# Altium schematic sheet 32B48P_Dev_Board.SchDoc
size A3
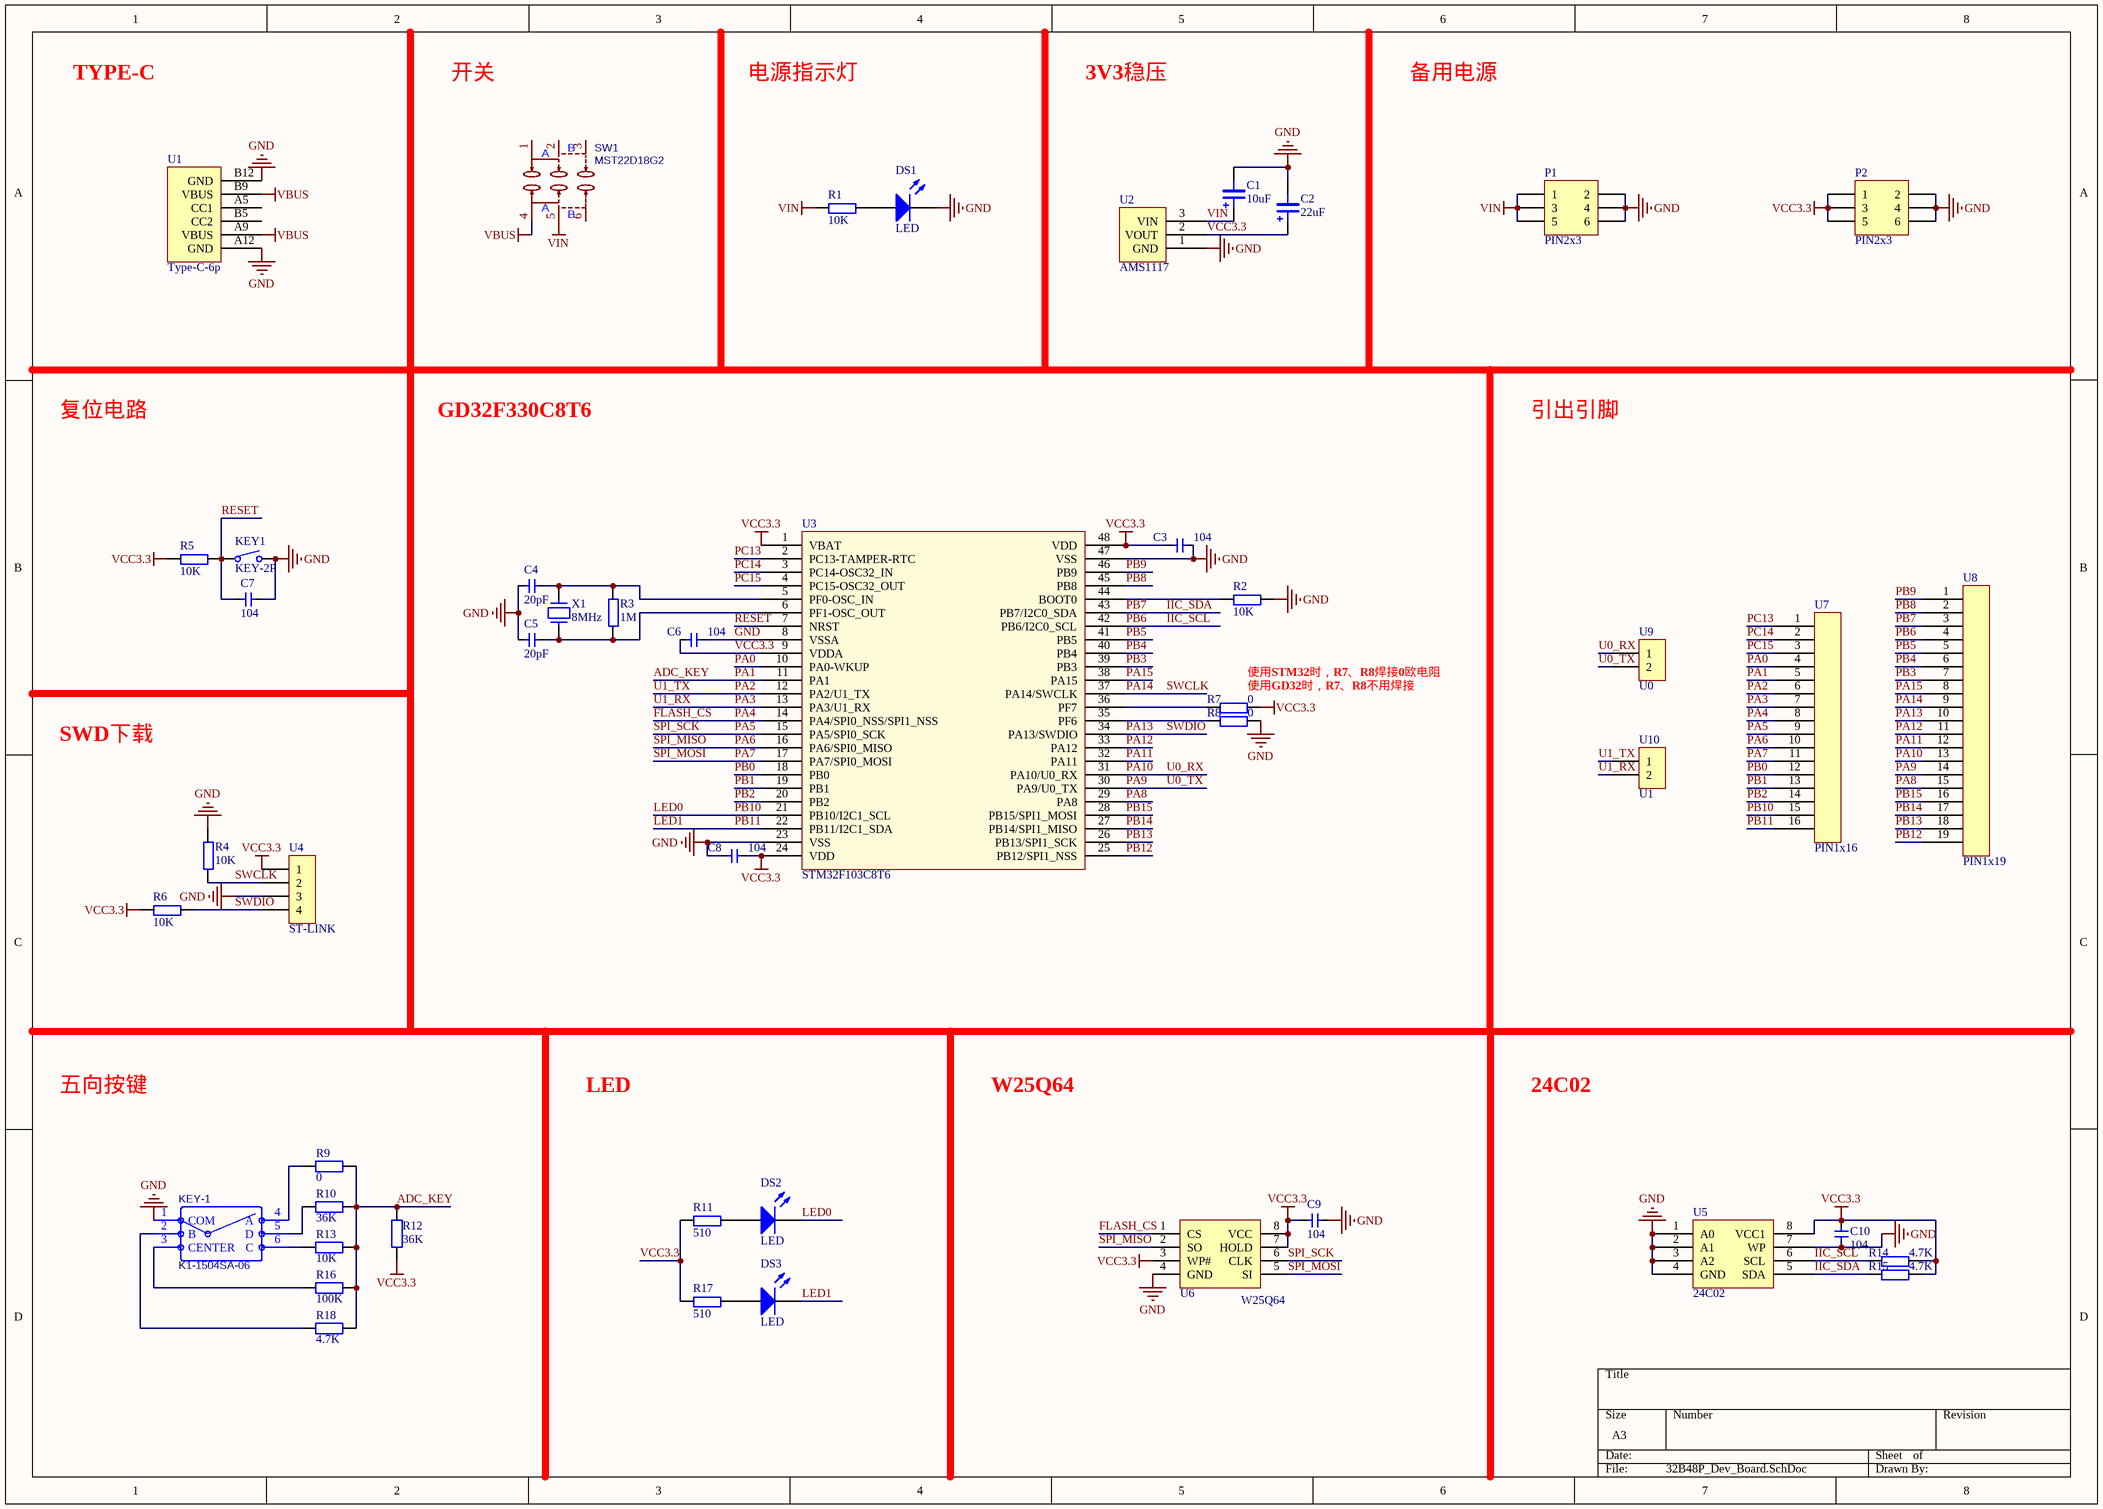
[diagram p0: 32B48P_Dev_Board.SchDoc]

## Parts
C1  10uF  [CAP-TANTALUM-A]
C2  22uF  [CAP-TANTALUM-A]
C3  104  [Cap_0603]
C4  20pF  [Cap_0603]
C5  20pF  [Cap_0603]
C6  104  [Cap_0603]
C7  104  [Cap_0603]
C8  104  [Cap_0603]
C9  104  [Cap_0603]
C10  104  [Cap_0603]
DS1  LED  [LED_0603]
DS2  LED  [LED_0603]
DS3  LED  [LED_0603]
KEY1  KEY-2P  [key3*6]
KEY-1  K1-1504SA-06  [SW-SMD_K1-1504SA-06]
P1  PIN2x3  [PIN-2x3-2.54-1.0]
P2  PIN2x3  [PIN-2x3-2.54-1.0]
R1  10K  [Res_0603]
R2  10K  [Res_0603]
R3  1M  [Res_0603]
R4  10K  [Res_0603]
R5  10K  [Res_0603]
R6  10K  [Res_0603]
R7  0  [Res_0603]
R8  0  [Res_0603]
R9  0  [Res_0603]
R10  36K  [Res_0603]
R11  510  [Res_0603]
R12  36K  [Res_0603]
R13  10K  [Res_0603]
R14  4.7K  [Res_0603]
R15  4.7K  [Res_0603]
R16  100K  [Res_0603]
R17  510  [Res_0603]
R18  4.7K  [Res_0603]
SW1  MST22D18G2  [6脚拨动开关]
U1  Type-C-6p  [TYPEC-6P]
U2  AMS1117  [SOT-89]
U3  STM32F103C8T6  [QFP-48-0.5]
U4  ST-LINK  [st-link]
U5  24C02  [SOIC-8]
U6  W25Q64  [SOIC-8]
U7  PIN1x16  [PIN1x16]
U8  PIN1x19  [PIN1x19]
U9  U0  [PIN-1x2-2.54]
U10  U1  [PIN-1x2-2.54]
X1  8MHz  [OSC 5032-2P]

## Nets
GND: C1.2 C2.2 C3.2 C4.1 C5.1 C6.2 C7.2 C8.1 C9.2 C10.1 DS1.2(K) KEY1.2 KEY-1.1(COM) P1.2 P1.4 P1.6 P2.2 P2.4 P2.6 R2.2 R4.2 R8.2 U1.A12(GND) U1.B12(GND) U2.1(GND) U3.8(VSSA) U3.23(VSS) U3.47(VSS) U4.3 U5.1(A0) U5.2(A1) U5.3(A2) U5.4(GND) U5.7(WP) U6.4(GND)
VBUS: SW1.4 U1.A9(VBUS) U1.B9(VBUS)
VCC3.3: C2.1 C3.1 C6.1 C8.2 C9.1 C10.2 P2.1 P2.3 P2.5 R5.1 R6.1 R7.2 R11.1 R12.1 R14.2 R15.2 R17.1 U2.2(VOUT) U3.1(VBAT) U3.9(VDDA) U3.24(VDD) U3.48(VDD) U4.1 U5.8(VCC1) U6.3(WP#) U6.7(HOLD) U6.8(VCC)
VIN: C1.1 P1.1 P1.3 P1.5 R1.1 SW1.5 U2.3(VIN)
ADC_KEY: R9.2 R10.2 R12.2 R13.2 R16.2 R18.2 U3.11(PA1) U7.5  [also labelled PA1]
FLASH_CS: U3.14(PA4/SPI0_NSS/SPI1_NSS) U6.1(CS) U7.8  [also labelled PA4]
IIC_SCL: R14.1 U3.42(PB6/I2C0_SCL) U5.6(SCL) U8.4  [also labelled PB6]
IIC_SDA: R15.1 U3.43(PB7/I2C0_SDA) U5.5(SDA) U8.3  [also labelled PB7]
LED0: DS2.2(K) U3.21(PB10/I2C1_SCL) U7.15  [also labelled PB10]
LED1: DS3.2(K) U3.22(PB11/I2C1_SDA) U7.16  [also labelled PB11]
PA0: U3.10(PA0-WKUP) U7.4
PA2: U3.12(PA2/U1_TX) U7.6 U10.1  [also labelled U1_TX]
PA3: U3.13(PA3/U1_RX) U7.7 U10.2  [also labelled U1_RX]
PA5: U3.15(PA5/SPI0_SCK) U6.6(CLK) U7.9  [also labelled SPI_SCK]
PA6: U3.16(PA6/SPI0_MISO) U6.2(SO) U7.10  [also labelled SPI_MISO]
PA7: U3.17(PA7/SPI0_MOSI) U6.5(SI) U7.11  [also labelled SPI_MOSI]
PA8: U3.29(PA8) U8.15
PA9: U3.30(PA9/U0_TX) U8.14 U9.2  [also labelled U0_TX]
PA10: U3.31(PA10/U0_RX) U8.13 U9.1  [also labelled U0_RX]
PA11: U3.32(PA11) U8.12
PA12: U3.33(PA12) U8.11
PA13: R6.2 U3.34(PA13/SWDIO) U4.4 U8.10  [also labelled SWDIO]
PA14: R4.1 U3.37(PA14/SWCLK) U4.2 U8.9  [also labelled SWCLK]
PA15: U3.38(PA15) U8.8
PB0: U3.18(PB0) U7.12
PB1: U3.19(PB1) U7.13
PB2: U3.20(PB2) U7.14
PB3: U3.39(PB3) U8.7
PB4: U3.40(PB4) U8.6
PB5: U3.41(PB5) U8.5
PB8: U3.45(PB8) U8.2
PB9: U3.46(PB9) U8.1
PB12: U3.25(PB12/SPI1_NSS) U8.19
PB13: U3.26(PB13/SPI1_SCK) U8.18
PB14: U3.27(PB14/SPI1_MISO) U8.17
PB15: U3.28(PB15/SPI1_MOSI) U8.16
PC13: U3.2(PC13-TAMPER-RTC) U7.1
PC14: U3.3(PC14-OSC32_IN) U7.2
PC15: U3.4(PC15-OSC32_OUT) U7.3
RESET: C7.1 KEY1.1 R5.2 U3.7(NRST)
NetC4_2: C4.2 R3.2 U3.5(PF0-OSC_IN) X1.1
NetC5_2: C5.2 R3.1 U3.6(PF1-OSC_OUT) X1.2
NetDS1_1: DS1.1(A) R1.2
NetDS2_1: DS2.1(A) R11.2
NetDS3_1: DS3.1(A) R17.2
NetKEY-1_2: KEY-1.2(B) R18.1
NetKEY-1_3: KEY-1.3(CENTER) R16.1
NetKEY-1_4: KEY-1.4(A) R9.1
NetKEY-1_5: KEY-1.5(D) R10.1
NetKEY-1_6: KEY-1.6(C) R13.1
NetR2_1: R2.1 U3.44(BOOT0)
NetR7_1: R7.1 U3.36(PF7)
NetR8_1: R8.1 U3.35(PF6)

Not connected (* = marked no-connect by the designer): SW1 1 2 3 6; U1 A5(CC1) B5(CC2)

## Notes on the sheet
- TYPE-C
- 开关
- 电源指示灯
- 3V3稳压
- 备用电源
- 复位电路
- GD32F330C8T6
- 引出引脚
- 使用STM32时，R7、R8焊接0欧电阻
- (near R7) 使用GD32时，R7、R8不用焊接
- SWD下载
- 五向按键
- LED
- W25Q64
- 24C02
- (in symbol 6脚拨动开关) B; A

## Library data of the parts
C1 C2 = CAP-TANTALUM: Tantalum Capacitor
C3-C10 = CAP: Capacitor; Value: 0.1u
KEY1 = KEY-2P: Switch
KEY-1 = K1-1504SA-06: 五向按键; BOM_Manufacturer: HRO; Contributor: LCSC; BOM_Supplier: LCSC; BOM_Manufacturer Part: K1-1504SA-06; BOM_Supplier Part: C136712; spicePre: S; spiceSymbolName: K1-1504SA-06
P1 P2 = PIN2x3: Connector
R1-R8 R11 R14 R15 R17 = RES
R9 R10 R12 R13 R16 R18 = RES: Resistor
SW1 = 6脚拨动开关: BOM_Manufacturer: SHOU HAN(首韩); Contributor: LCSC; BOM_Supplier: LCSC; BOM_Supplier Part: C431544; BOM_Manufacturer Part: MST22D18G2; BOM_JLCPCB Part Class: Extended Part; spicePre: S; spiceSymbolName: MST22D18G2
U3 = GD32F330Cx
U4 = PIN1x4: Connector
U9 U10 = PIN1x2: Connector
X1 = Crystal
DS1-DS3 = LED: Published: 8-Jun-2000; LatestRevisionDate: 17-Jul-2002; LatestRevisionNote: Re-released for DXP Platform.; PackageDocument: Feb-2002; PackageReference: 3.2X1.6X1.1; Publisher: Altium Limited